# Altium schematic sheet TopLevel.SchDoc: =project_title
size Tabloid; CompanyName: Luxonis Holding; Organization: Luxonis Holding; Address1: 1925 Harmony Park Drive; Address2: Westminster, CO; Address3: 80234; Address4: United States; SheetNumber: 1; SheetTotal: 15
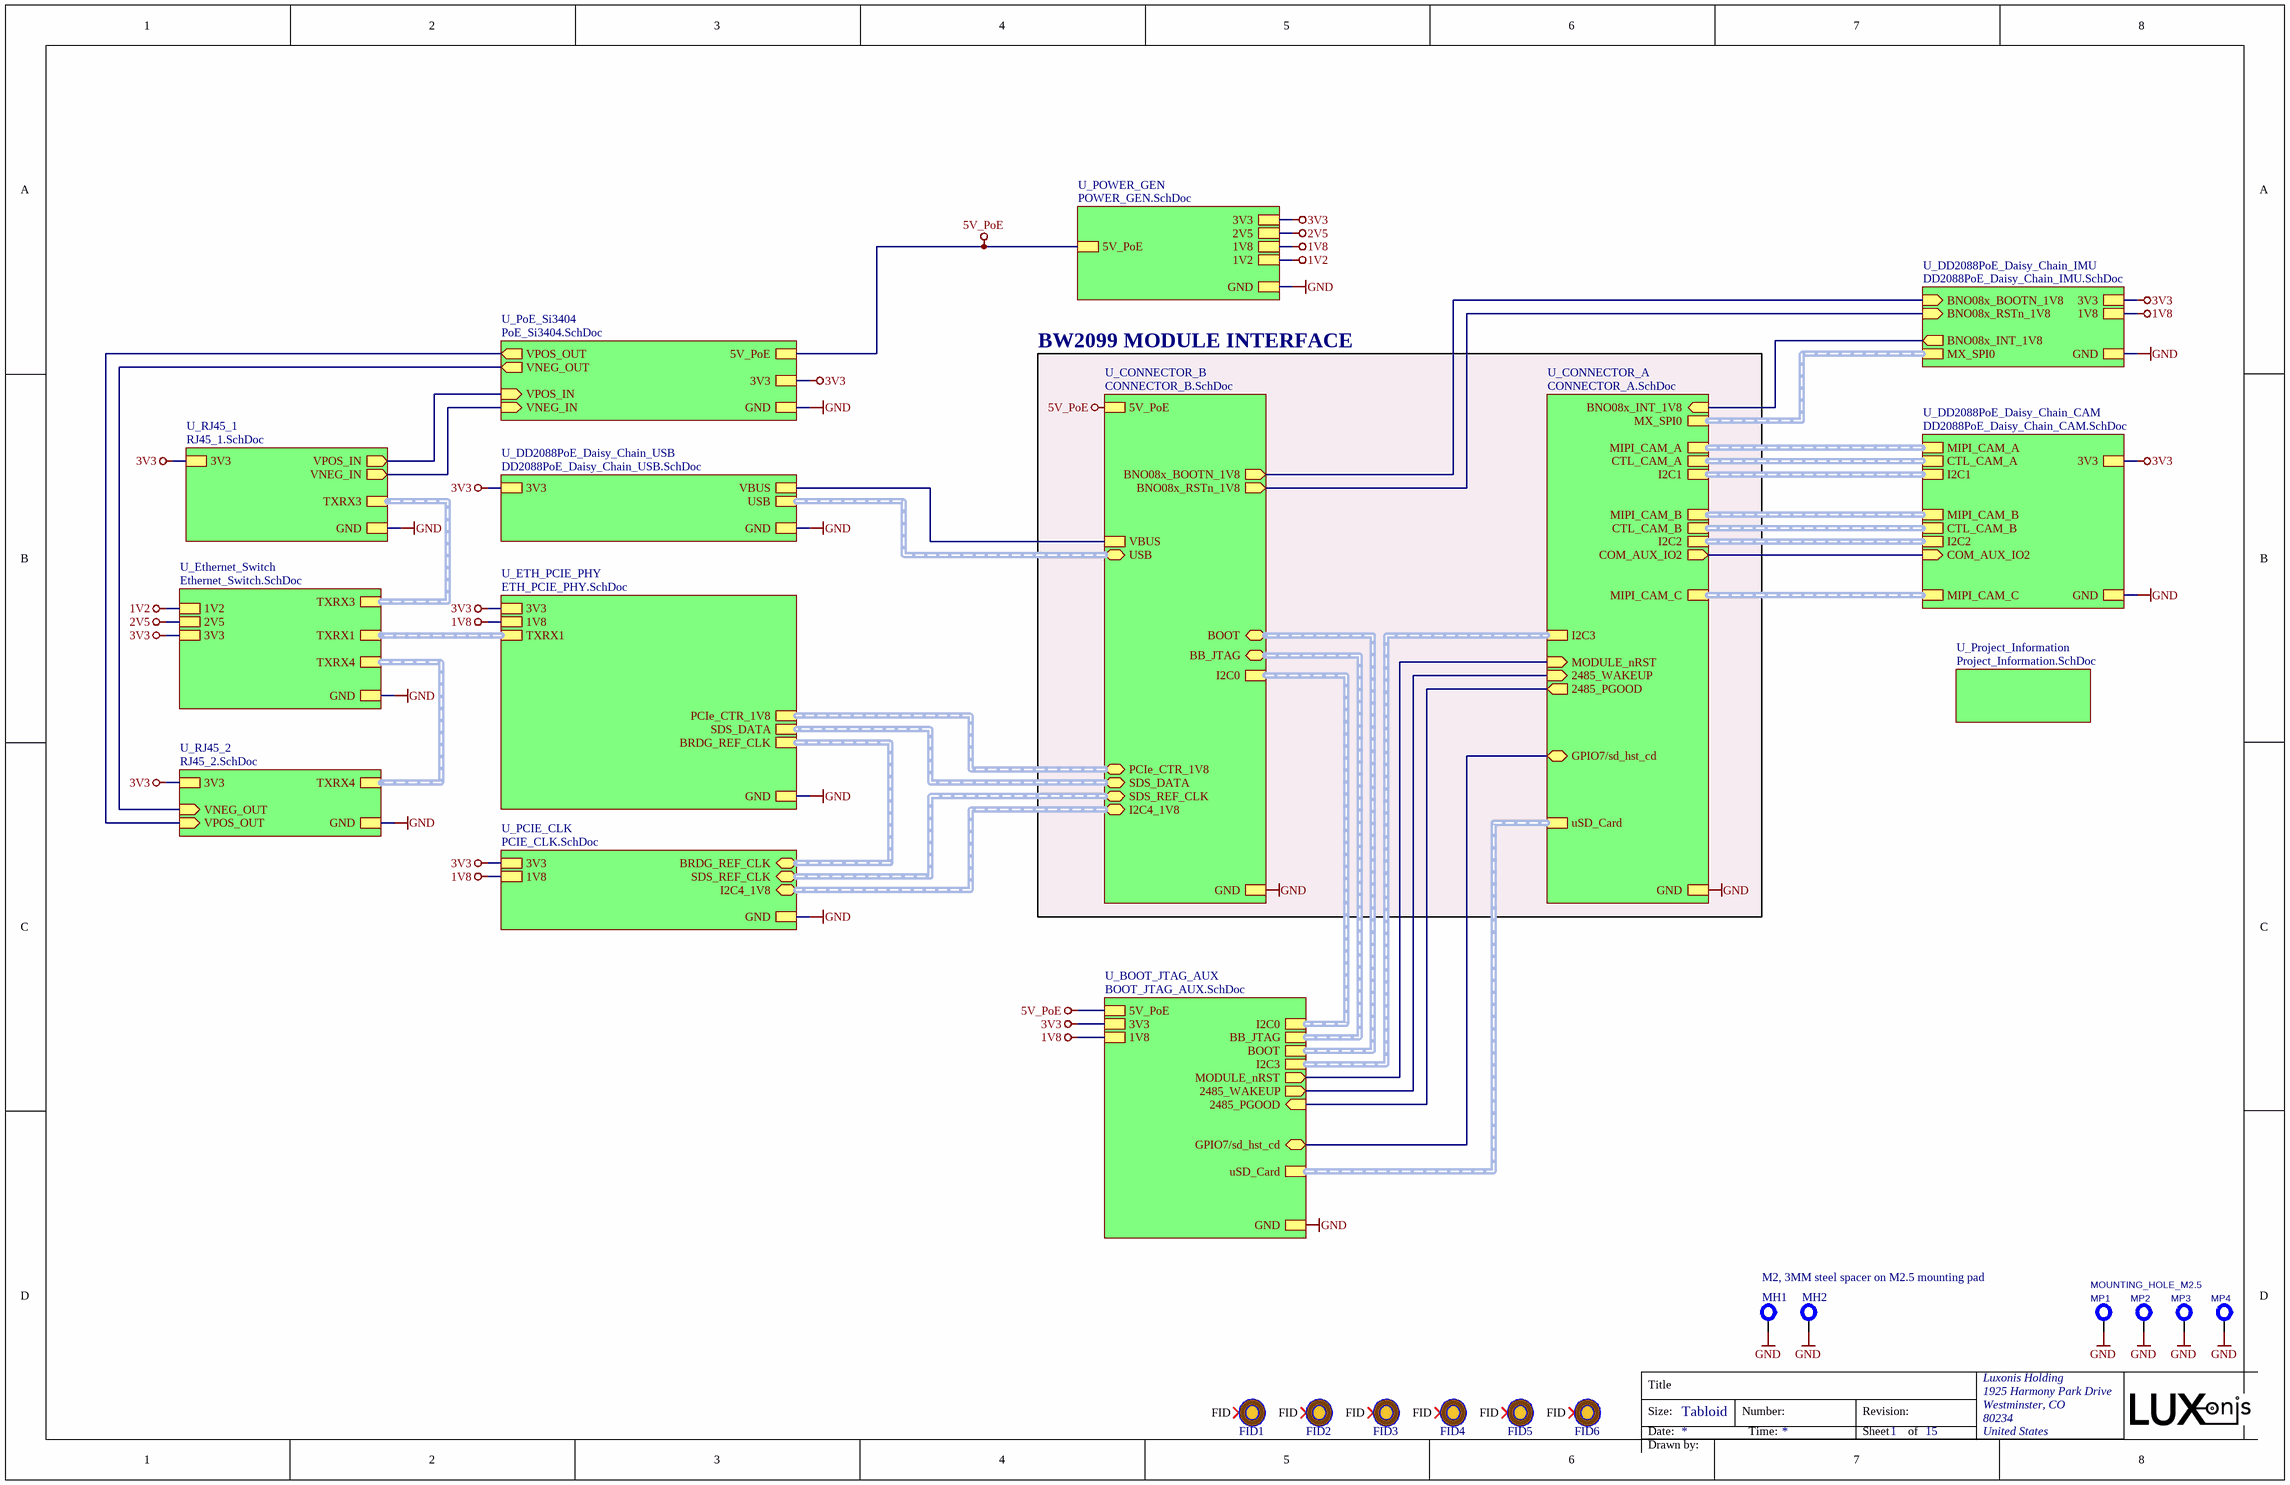
[diagram p0: TopLevel.SchDoc]

## Parts
FID1  FIDUCIAL_ROUND_1MM  [FIDUCIAL_ROUND_1MM]  (value not drawn)  (no BOM)
FID2  FIDUCIAL_ROUND_1MM  [FIDUCIAL_ROUND_1MM]  (value not drawn)  (no BOM)
FID3  FIDUCIAL_ROUND_1MM  [FIDUCIAL_ROUND_1MM]  (value not drawn)  (no BOM)
FID4  FIDUCIAL_ROUND_1MM  [FIDUCIAL_ROUND_1MM]  (value not drawn)  (no BOM)
FID5  FIDUCIAL_ROUND_1MM  [FIDUCIAL_ROUND_1MM]  (value not drawn)  (no BOM)
FID6  FIDUCIAL_ROUND_1MM  [FIDUCIAL_ROUND_1MM]  (value not drawn)  (no BOM)
MH1  M2, 3MM steel spacer on M2.5 mounting pad  [9774030243R]
MH2  M2, 3MM steel spacer on M2.5 mounting pad  [9774030243R]  (value not drawn)
MP1  MOUNTING_HOLE_M2.5  [MOUNTING_HOLE_M2.5]  (no BOM)
MP2  MOUNTING_HOLE_M2.5  [MOUNTING_HOLE_M2.5]  (value not drawn)  (no BOM)
MP3  MOUNTING_HOLE_M2.5  [MOUNTING_HOLE_M2.5]  (value not drawn)  (no BOM)
MP4  MOUNTING_HOLE_M2.5  [MOUNTING_HOLE_M2.5]  (value not drawn)  (no BOM)

## Sub-sheets
U_BOOT_JTAG_AUX = BOOT_JTAG_AUX.SchDoc: BOOT (harness BOOT), BB_JTAG (harness BB_JTAG), uSD_Card (harness uSD_Card), 2485_WAKEUP (out), I2C3 (harness I2C3), MODULE_nRST (out), 2485_PGOOD (in), 1V8, 3V3, GND, 5V_PoE, I2C0 (harness I2C0), GPIO7/sd_hst_cd (bidir)
U_CONNECTOR_A = CONNECTOR_A.SchDoc: I2C2 (harness I2C2), I2C1 (harness I2C1), uSD_Card (harness uSD_Card), MIPI_CAM_C (harness MIPI_CAM_C), CTL_CAM_A (harness CTL_CAM_A), MIPI_CAM_A (harness MIPI_CAM_A), MIPI_CAM_B (harness MIPI_CAM_B), GND, I2C3 (harness I2C3), CTL_CAM_B (harness CTL_CAM_B), COM_AUX_IO2 (out), MODULE_nRST (in), 2485_WAKEUP (in), 2485_PGOOD (out), GPIO7/sd_hst_cd (bidir), BNO08x_INT_1V8 (in), MX_SPI0 (harness MX_SPI0)
U_CONNECTOR_B = CONNECTOR_B.SchDoc: VBUS, I2C0 (harness I2C0), 5V_PoE, GND, BOOT (bidir, harness BOOT), PCIe_CTR_1V8 (bidir, harness PCIe_CTR_1V8), BB_JTAG (bidir, harness BB_JTAG), USB (bidir, harness USB), SDS_REF_CLK (bidir, harness SDS_REF_CLK), I2C4_1V8 (bidir, harness I2C4_1V8), SDS_DATA (bidir, harness Harness), BNO08x_BOOTN_1V8 (out), BNO08x_RSTn_1V8 (out)
U_DD2088PoE_Daisy_Chain_CAM = DD2088PoE_Daisy_Chain_CAM.SchDoc: MIPI_CAM_B (harness MIPI_CAM_B), I2C2 (harness I2C2), I2C1 (harness I2C1), MIPI_CAM_A (harness MIPI_CAM_A), MIPI_CAM_C (harness MIPI_CAM_C), CTL_CAM_A (harness CTL_CAM_A), GND, 3V3, COM_AUX_IO2 (in), CTL_CAM_B (harness CTL_CAM_B)
U_DD2088PoE_Daisy_Chain_IMU = DD2088PoE_Daisy_Chain_IMU.SchDoc: BNO08x_BOOTN_1V8 (in), GND, 3V3, BNO08x_INT_1V8 (out), BNO08x_RSTn_1V8 (in), 1V8, MX_SPI0 (harness MX_SPI0)
U_DD2088PoE_Daisy_Chain_USB = DD2088PoE_Daisy_Chain_USB.SchDoc: USB (harness USB), GND, 3V3, VBUS
U_ETH_PCIE_PHY = ETH_PCIE_PHY.SchDoc: TXRX1 (harness ETH_DATA), SDS_DATA (harness Harness), 3V3, GND, BRDG_REF_CLK (harness BRDG_REF_CLK), 1V8, PCIe_CTR_1V8 (harness PCIe_CTR_1V8)
U_Ethernet_Switch = Ethernet_Switch.SchDoc: TXRX4 (harness RJ45_2), TXRX1 (harness RTL8111), TXRX3 (harness RJ45_1), GND, 3V3, 2V5, 1V2
U_PCIE_CLK = PCIE_CLK.SchDoc: GND, 3V3, 1V8, BRDG_REF_CLK (bidir, harness BRDG_REF_CLK), I2C4_1V8 (bidir, harness I2C4_1V8), SDS_REF_CLK (bidir, harness SDS_REF_CLK)
U_PoE_Si3404 = PoE_Si3404.SchDoc: 5V_PoE, GND, VPOS_IN (in), VNEG_IN (in), VNEG_OUT (out), VPOS_OUT (out), 3V3
U_POWER_GEN = POWER_GEN.SchDoc: GND, 3V3, 1V8, 5V_PoE, 1V2, 2V5
U_Project_Information = Project_Information.SchDoc: no entries
U_RJ45_1 = RJ45_1.SchDoc: GND, 3V3, VPOS_IN (out), VNEG_IN (out), TXRX3 (harness RJ45_1)
U_RJ45_2 = RJ45_2.SchDoc: GND, 3V3, VNEG_OUT (in), VPOS_OUT (in), TXRX4 (harness RJ45_2)

## Nets
1V2: sheet U_POWER_GEN/1V2, sheet U_Ethernet_Switch/1V2
1V8: sheet U_ETH_PCIE_PHY/1V8, sheet U_PCIE_CLK/1V8, sheet U_BOOT_JTAG_AUX/1V8, sheet U_POWER_GEN/1V8, sheet U_DD2088PoE_Daisy_Chain_IMU/1V8
2V5: sheet U_POWER_GEN/2V5, sheet U_Ethernet_Switch/2V5
3V3: sheet U_ETH_PCIE_PHY/3V3, sheet U_PCIE_CLK/3V3, sheet U_DD2088PoE_Daisy_Chain_USB/3V3, sheet U_BOOT_JTAG_AUX/3V3, sheet U_POWER_GEN/3V3, sheet U_DD2088PoE_Daisy_Chain_IMU/3V3, sheet U_RJ45_1/3V3, sheet U_RJ45_2/3V3, sheet U_DD2088PoE_Daisy_Chain_CAM/3V3, sheet U_Ethernet_Switch/3V3, sheet U_PoE_Si3404/3V3
5V_PoE: sheet U_CONNECTOR_B/5V_PoE, sheet U_BOOT_JTAG_AUX/5V_PoE, sheet U_POWER_GEN/5V_PoE, sheet U_PoE_Si3404/5V_PoE
GND: MH1.1 MH2.1 MP1.1 MP2.1 MP3.1 MP4.1 ; sheet U_CONNECTOR_B/GND, sheet U_CONNECTOR_A/GND, sheet U_ETH_PCIE_PHY/GND, sheet U_PCIE_CLK/GND, sheet U_DD2088PoE_Daisy_Chain_USB/GND, sheet U_BOOT_JTAG_AUX/GND, sheet U_POWER_GEN/GND, sheet U_DD2088PoE_Daisy_Chain_IMU/GND, sheet U_RJ45_1/GND, sheet U_RJ45_2/GND, sheet U_DD2088PoE_Daisy_Chain_CAM/GND, sheet U_Ethernet_Switch/GND, sheet U_PoE_Si3404/GND
(unnamed): sheet U_CONNECTOR_B/VBUS, sheet U_DD2088PoE_Daisy_Chain_USB/VBUS
(unnamed): sheet U_CONNECTOR_B/BNO08x_BOOTN_1V8, sheet U_DD2088PoE_Daisy_Chain_IMU/BNO08x_BOOTN_1V8
(unnamed): sheet U_CONNECTOR_B/BNO08x_RSTn_1V8, sheet U_DD2088PoE_Daisy_Chain_IMU/BNO08x_RSTn_1V8
(unnamed): sheet U_CONNECTOR_A/COM_AUX_IO2, sheet U_DD2088PoE_Daisy_Chain_CAM/COM_AUX_IO2
(unnamed): sheet U_CONNECTOR_A/MODULE_nRST, sheet U_BOOT_JTAG_AUX/MODULE_nRST
(unnamed): sheet U_CONNECTOR_A/2485_WAKEUP, sheet U_BOOT_JTAG_AUX/2485_WAKEUP
(unnamed): sheet U_CONNECTOR_A/2485_PGOOD, sheet U_BOOT_JTAG_AUX/2485_PGOOD
(unnamed): sheet U_CONNECTOR_A/GPIO7/sd_hst_cd, sheet U_BOOT_JTAG_AUX/GPIO7/sd_hst_cd
(unnamed): sheet U_CONNECTOR_A/BNO08x_INT_1V8, sheet U_DD2088PoE_Daisy_Chain_IMU/BNO08x_INT_1V8
(unnamed): sheet U_RJ45_1/VPOS_IN, sheet U_PoE_Si3404/VPOS_IN
(unnamed): sheet U_RJ45_1/VNEG_IN, sheet U_PoE_Si3404/VNEG_IN
(unnamed): sheet U_RJ45_2/VNEG_OUT, sheet U_PoE_Si3404/VNEG_OUT
(unnamed): sheet U_RJ45_2/VPOS_OUT, sheet U_PoE_Si3404/VPOS_OUT

Not connected (* = marked no-connect by the designer): FID1 FID*; FID2 FID*; FID3 FID*; FID4 FID*; FID5 FID*; FID6 FID*

## Buses and harness runs
harness sheet U_BOOT_JTAG_AUX/BB_JTAG = sheet U_CONNECTOR_B/BB_JTAG
harness sheet U_BOOT_JTAG_AUX/BOOT = sheet U_CONNECTOR_B/BOOT
harness sheet U_BOOT_JTAG_AUX/I2C0 = sheet U_CONNECTOR_B/I2C0
harness sheet U_BOOT_JTAG_AUX/I2C3 = sheet U_CONNECTOR_A/I2C3
harness sheet U_BOOT_JTAG_AUX/uSD_Card = sheet U_CONNECTOR_A/uSD_Card
harness sheet U_CONNECTOR_A/CTL_CAM_A = sheet U_DD2088PoE_Daisy_Chain_CAM/CTL_CAM_A
harness sheet U_CONNECTOR_A/CTL_CAM_B = sheet U_DD2088PoE_Daisy_Chain_CAM/CTL_CAM_B
harness sheet U_CONNECTOR_A/I2C1 = sheet U_DD2088PoE_Daisy_Chain_CAM/I2C1
harness sheet U_CONNECTOR_A/I2C2 = sheet U_DD2088PoE_Daisy_Chain_CAM/I2C2
harness sheet U_CONNECTOR_A/MIPI_CAM_A = sheet U_DD2088PoE_Daisy_Chain_CAM/MIPI_CAM_A
harness sheet U_CONNECTOR_A/MIPI_CAM_B = sheet U_DD2088PoE_Daisy_Chain_CAM/MIPI_CAM_B
harness sheet U_CONNECTOR_A/MIPI_CAM_C = sheet U_DD2088PoE_Daisy_Chain_CAM/MIPI_CAM_C
harness sheet U_CONNECTOR_A/MX_SPI0 = sheet U_DD2088PoE_Daisy_Chain_IMU/MX_SPI0
harness sheet U_CONNECTOR_B/I2C4_1V8 = sheet U_PCIE_CLK/I2C4_1V8
harness sheet U_CONNECTOR_B/PCIe_CTR_1V8 = sheet U_ETH_PCIE_PHY/PCIe_CTR_1V8
harness sheet U_CONNECTOR_B/SDS_DATA = sheet U_ETH_PCIE_PHY/SDS_DATA
harness sheet U_CONNECTOR_B/SDS_REF_CLK = sheet U_PCIE_CLK/SDS_REF_CLK
harness sheet U_CONNECTOR_B/USB = sheet U_DD2088PoE_Daisy_Chain_USB/USB
harness sheet U_ETH_PCIE_PHY/BRDG_REF_CLK = sheet U_PCIE_CLK/BRDG_REF_CLK
harness sheet U_ETH_PCIE_PHY/TXRX1 = sheet U_Ethernet_Switch/TXRX1
harness sheet U_Ethernet_Switch/TXRX3 = sheet U_RJ45_1/TXRX3
harness sheet U_Ethernet_Switch/TXRX4 = sheet U_RJ45_2/TXRX4

## Notes on the sheet
- BW2099 MODULE INTERFACE
- Title
- Size:
- Date:
- Tabloid
- Number:
- Time:
- Revision:
- Sheet
- of
- Drawn by:

## Library data of the parts
FID1-FID6 = FIDUCIAL: Fiducial with various available footprints
MH1 MH2 = 9774030243R: MP ROUND STANDOFF M2X0.4 STEEL 3MM; Manufacturer 1: Wurth Electronics; Plating: Tin; Threaded/Unthreaded: Threaded; Outside Diameter: 0.171inch; Supplier 1: Digi-Key; Manufacturer Part Number 1: 9774030243R; Stock 1: 20568; Pricing 1: 1=0.95000, 10=0.91800, 50=0.79500, 100=0.73900 (USD); RoHS: Yes; Material: Steel; Length: 0.173inch; REACH SVHC: Unknown; ComponentLink1URL: http://www.mouser.com/ds/2/445/9774030243R-611455.pdf?src-supplier=Mouser; ComponentLink1Description: http://www.mouser.com/ds/2/445/9774030243R-611455.pdf?src-supplier=Mouser; ComponentLink2URL: http://www.farnell.com/datasheets/1960368.pdf?src-supplier=Farnell; ComponentLink2Description: http://www.farnell.com/datasheets/1960368.pdf?src-supplier=Farnell; ComponentLink3URL: https://katalog.we-online.de/em/datasheet/9774030243R.pdf?src-supplier=Digi-Key; ComponentLink3Description: https://katalog.we-online.de/em/datasheet/9774030243R.pdf?src-supplier=Digi-Key; ComponentLink4URL: http://www.farnell.com/datasheets/1960368.pdf?src-supplier=Newark; ComponentLink4Description: http://www.farnell.com/datasheets/1960368.pdf?src-supplier=Newark; ComponentLink5URL: http://www.farnell.com/datasheets/1960368.pdf?src-supplier=Element14; ComponentLink5Description: http://www.farnell.com/datasheets/1960368.pdf?src-supplier=Element14; Supplier Part Number 1: 732-7085-1-ND; Supplier 2: Mouser; Supplier Part Number 2: 710-9774030243R; Supplier 3: Element14; Supplier Part Number 3: 2497599
MP1-MP4 = MP_Mounting-Holes: =CurrentFootprint; B - Value: Not a Part; A - Level: 0